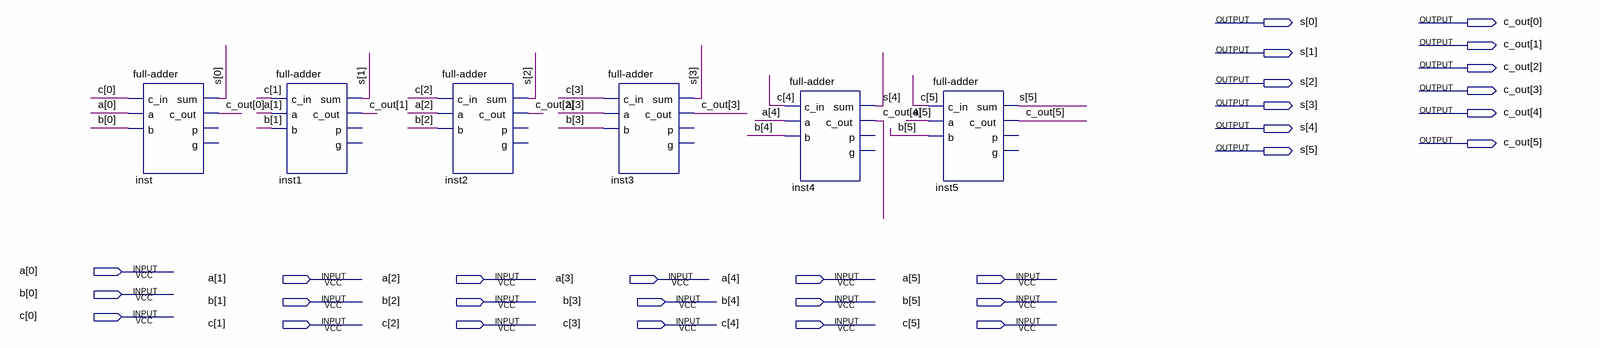
[diagram p0: schematic sheet]
// Quartus schematic Carry_Save_Adder.bdf as structural Verilog: 6 symbols, 30 pins
module Carry_Save_Adder (
  input  [5:0] a,
  input  [5:0] b,
  input  [5:0] c,
  output [5:0] s,
  output [5:0] c_out
);

  \full-adder  inst (.c_in(c[0]), .a(a[0]), .b(b[0]), .sum(s[0]), .c_out(c_out[0]));  // open: p, g
  \full-adder  inst1 (.c_in(c[1]), .a(a[1]), .b(b[1]), .sum(s[1]), .c_out(c_out[1]));  // open: p, g
  \full-adder  inst2 (.c_in(c[2]), .a(a[2]), .b(b[2]), .sum(s[2]), .c_out(c_out[2]));  // open: p, g
  \full-adder  inst3 (.c_in(c[3]), .a(a[3]), .b(b[3]), .sum(s[3]), .c_out(c_out[3]));  // open: p, g
  \full-adder  inst4 (.c_in(c[4]), .a(a[4]), .b(b[4]), .sum(s[4]), .c_out(c_out[4]));  // open: p, g
  \full-adder  inst5 (.c_in(c[5]), .a(a[5]), .b(b[5]), .sum(s[5]), .c_out(c_out[5]));  // open: p, g
endmodule
